# Altium schematic sheet Cell.SchDoc
size A4; SheetNumber: 3; SheetTotal: 4
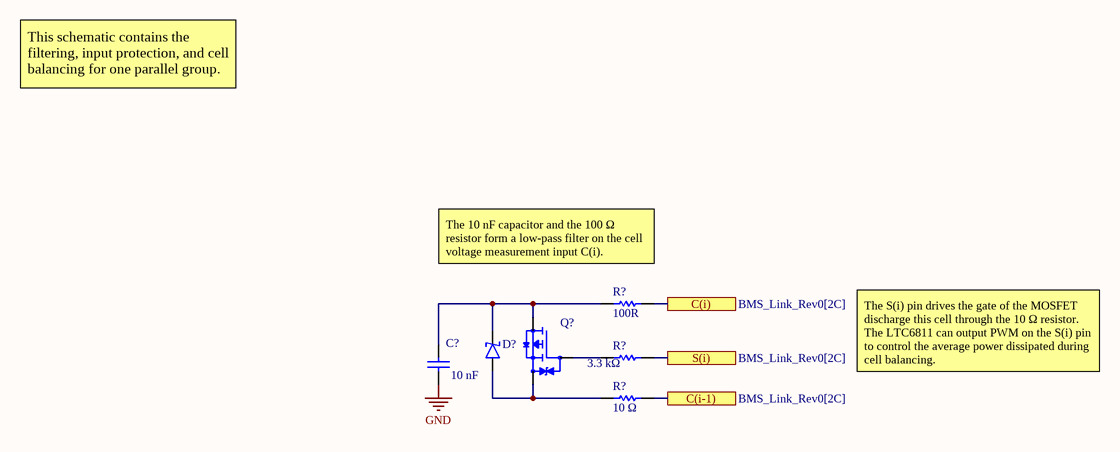
[diagram p0: Cell.SchDoc]

## Parts
(Parts that share a designator on the sheet are numbered #1, #2 ... from top to bottom, then left to right.)
C?  value 10 nF  [0805_CAPACITOR]  (hidden comment: CL21B103KBANNNC)
D?  SMAZ6V8-13-F  [SMA_DO-214AC_DIODE]  (value not drawn)
Q?  BSS308PE  [TRANS_SOT23]  (value not drawn)
R?#1  value 100R  [0805_RESISTOR]  (hidden comment: ERA-6AEB101V)
R?#2  value 3.3 kΩ  [0805_RESISTOR]  (hidden comment: RC0805FR-073K3L)
R?#3  value 10 Ω  [RES_3540_TEC-M]  (hidden comment: 354010RFT)

## Ports
C(i) (see BMS_Link_Rev0[2C]), C(i-1) (see BMS_Link_Rev0[2C]), S(i) (see BMS_Link_Rev0[2C])

## Nets
GND: C?.2
C(i): R?#1.2 ; port C(i)
C(i-1): R?#3.1 ; port C(i-1)
S(i): R?#2.1 ; port S(i)
NetC?_1: C?.1 D?.2(K) Q?.3(D) R?#1.1
NetD?_1: D?.1(A) Q?.2(S) R?#3.2
NetQ?_1: Q?.1(G) R?#2.2

## Notes on the sheet
- This schematic contains the filtering, input protection, and cell balancing for one parallel group.
- (near R?#1) The 10 nF capacitor and the 100 Ω resistor form a low-pass filter on the cell voltage measurement input C(i).
- The S(i) pin drives the gate of the MOSFET discharge this cell through the 10 Ω resistor. The LTC6811 can output PWM on the S(i) pin to control the average power dissipated during cell balancing.

## Library data of the parts
C? = CL21B103KBANNNC: 10 nF ±10% 50V Ceramic Capacitor X7R 0805 (2012 Metric)
D? = SMAZ6V8-13-F: Zener Diode 6.8 V 1 W ±5% Surface Mount SMA DO-214AC
Q? = BSS308PE: P-Channel 30 V 2A (Ta) 500mW (Ta) Surface Mount PG-SOT23; MF: Infineon; SnapEDA_Link: https://www.snapeda.com/parts/BSS308PE/Infineon/view-part/?ref=snap; Package: SOT-23 Infineon Technologies; Value: *; MP: BSS308PE; Check_prices: https://www.snapeda.com/parts/BSS308PE/Infineon/view-part/?ref=eda
R?#1 = ERA-6AEB101V: 100 Ohms ±0.1% 0.125W, 1/8W Chip Resistor 0805 (2012 Metric) Automotive AEC-Q200 Thin Film
R?#2 = RC0805FR-073K3L: 3.3 kOhms ±1% 0.125W, 1/8W Chip Resistor 0805 (2012 Metric) Moisture Resistant Thick Film
R?#3 = 354010RFT: 3540 10R 1%